# EAGLE design esp32-weatherstation-v1 (EAGLE 9.1.3)
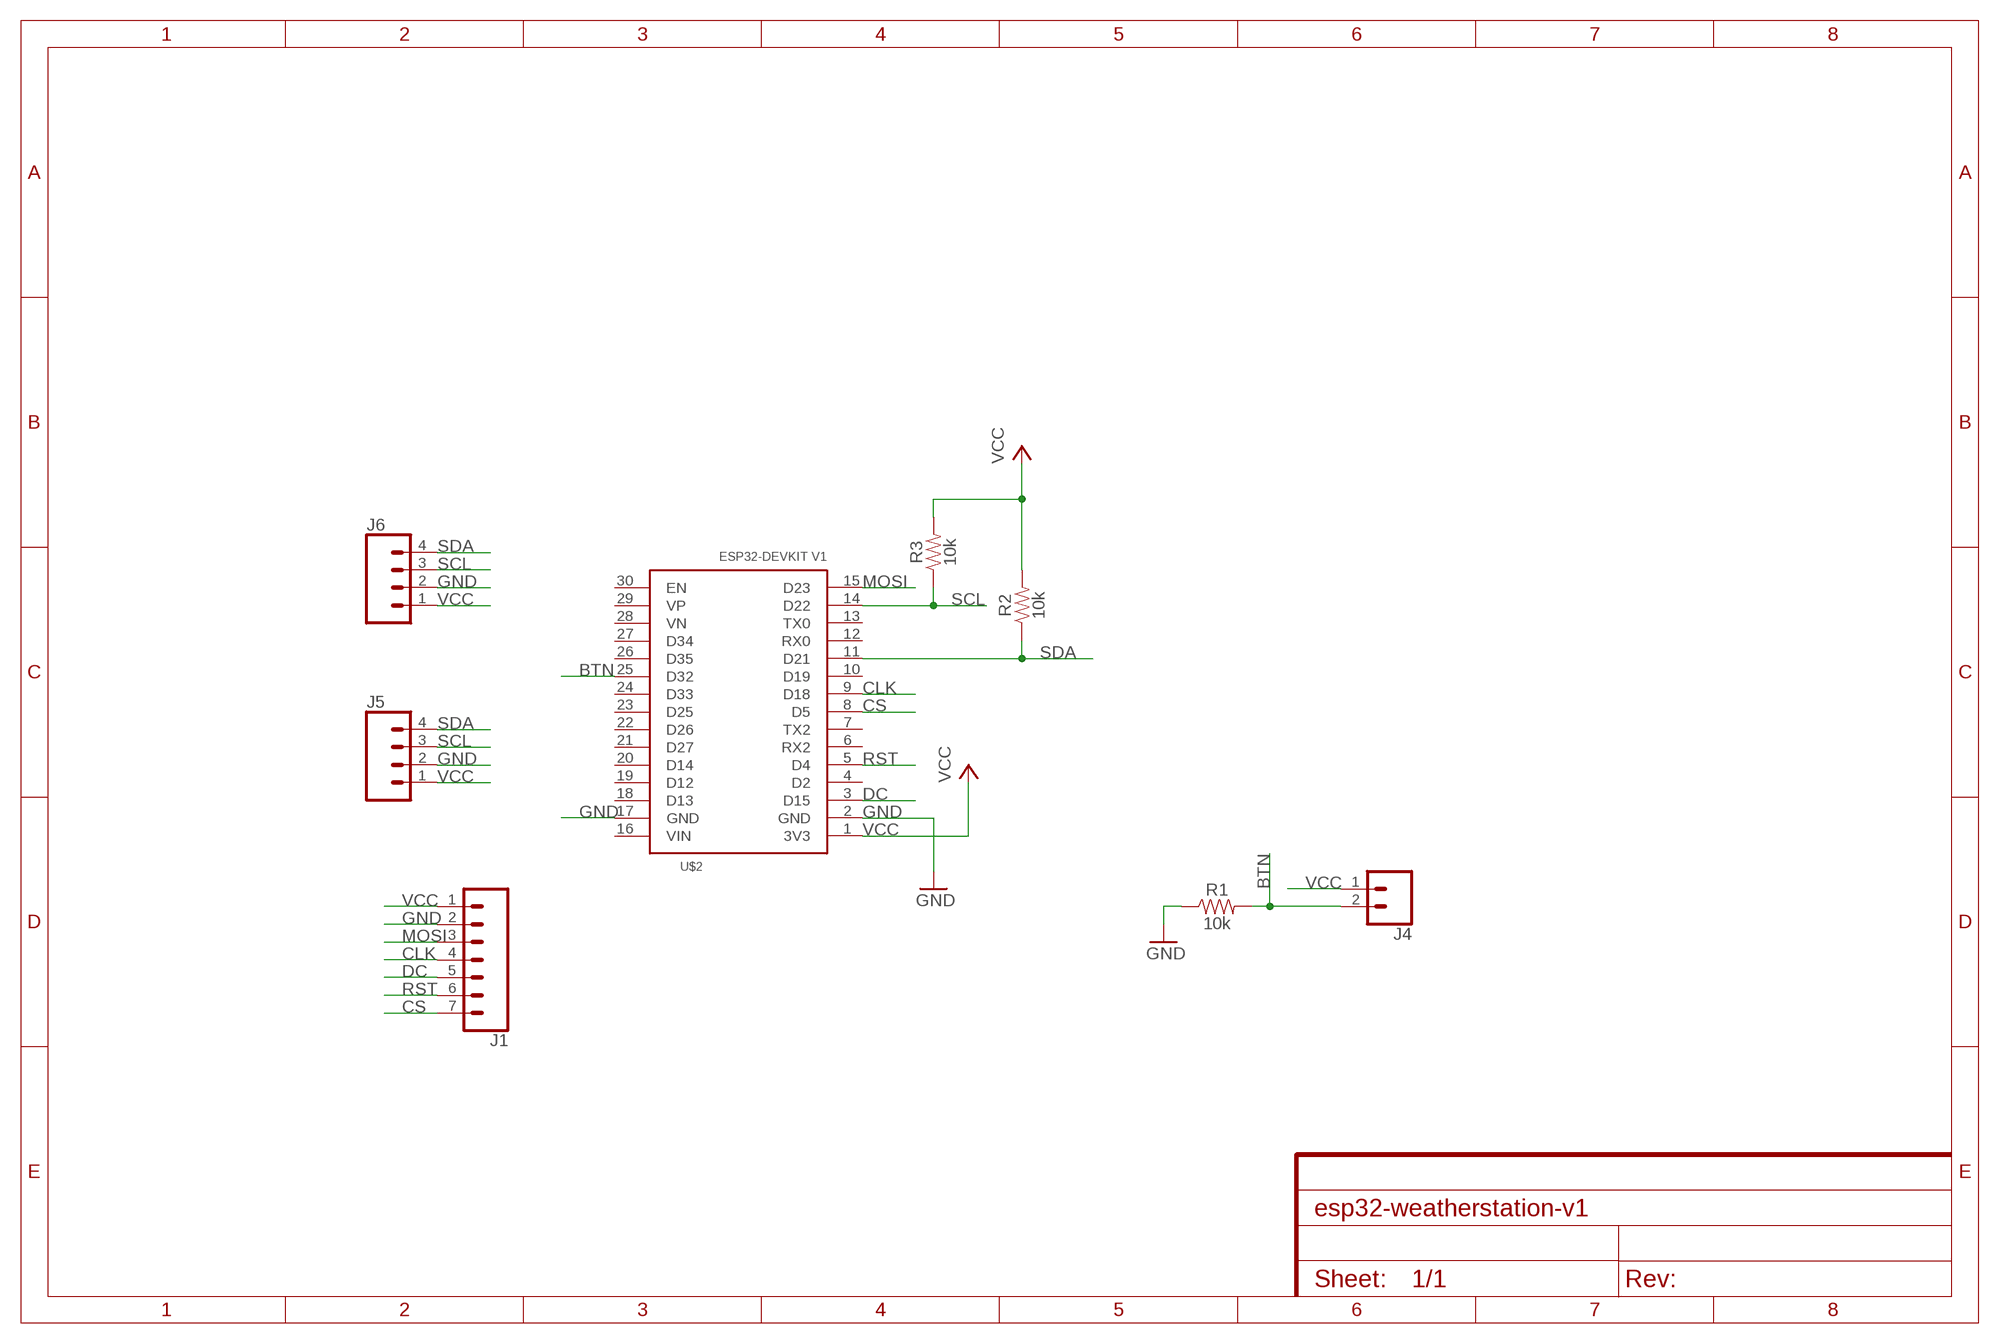
[diagram p0: schematic, sheet 1]

## Parts
J1  CONN_07  [1X07]
J4  CONN_02  [1X02]
J5  CONN_04POLAR  [MOLEX-1X4]
J6  CONN_04POLAR  [MOLEX-1X4]
R1  10k  10KOHM-HORIZ-1/4W-1%  [AXIAL-0.3]
R2  10k  10KOHM-HORIZ-1/4W-1%  [AXIAL-0.3]
R3  10k  10KOHM-HORIZ-1/4W-1%  [AXIAL-0.3]
U$2  DOIT-ESP32DEVKIT1  [ESP32-DEVKITV1]

## Nets
BTN: J4.2 R1.P$2 U$2.25(D32)
CLK: J1.4 U$2.9(D18)
CS: J1.7 U$2.8(D5)
DC: J1.5 U$2.3(D15)
GND: J1.2 J5.2 J6.2 R1.P$1 U$2.2(GND) U$2.17(GND)
MOSI: J1.3 U$2.15(D23)
RST: J1.6 U$2.5(D4)
SCL: J5.3 J6.3 R3.P$1 U$2.14(D22)
SDA: J5.4 J6.4 R2.P$1 U$2.11(D21)
VCC: J1.1 J4.1 J5.1 J6.1 R2.P$2 R3.P$2 U$2.1(3V3)
Unconnected: U$2.4(D2) U$2.6(RX2) U$2.7(TX2) U$2.10(D19) U$2.12(RX0) U$2.13(TX0) U$2.16(VIN) U$2.18(D13) U$2.19(D12) U$2.20(D14) U$2.21(D27) U$2.22(D26) U$2.23(D25) U$2.24(D33) U$2.26(D35) U$2.27(D34) U$2.28(VN) U$2.29(VP) U$2.30(EN)

## Library data of the parts
J1 = SparkFun-Connectors:CONN_07: Multi connection point. Often used as Generic Header-pin footprint for 0.1 inch spaced/style header connections On any of the 0.1 inch spaced packages, you can populate with these: Break Away Headers - Straight <https://www.sparkfun.com/products/116> (PRT-00116) Break Away Male Headers - Right Angle <https://www.sparkfun.com/products/553> (PRT-00553) Female Headers <https://www.sparkfun.com/products/115> (PRT-00115) Break Away Headers - Machine Pin <https://www.sparkfun.com/products/117> (PRT-00117) Break Away Female Headers - Swiss Machine Pin <https://www.sparkfun.com/products/743> (PRT-00743) For SCREWTERMINALS and SPRING TERMINALS visit here: Screw Terimnals on SparkFun.com <https://www.sparkfun.com/search/results?term=Screw+Terminals> (5mm/3.5mm/2.54mm spacing) This device is also useful as a general connection point to wire up your design to another part of your project. Our various solder wires solder well into these plated through hole pads. Hook-Up Wire - Assortment (Stranded, 22 AWG) <https://www.sparkfun.com/products/11375> (PRT-11375) Hook-Up Wire - Assortment (Solid Core, 22 AWG) <https://www.sparkfun.com/products/11367> (PRT-11367) View the entire wire category on our website here <https://www.sparkfun.com/categories/141> Special notes: Molex polarized connector foot print use with SKU : PRT-08231 with associated crimp pins and housings. 1MM SMD Version SKU: PRT-10208 NOTES ON THE VARIANTS LOCK and LOCK_LONGPADS... This footprint was designed to help hold the alignment of a through-hole component (i.e. 6-pin header) while soldering it into place. You may notice that each hole has been shifted either up or down by 0.005 of an inch from it's more standard position (which is a perfectly straight line). This slight alteration caused the pins (the squares in the middle) to touch the edges of the holes. Because they are alternating, it causes a "brace" to hold the component in place. 0.005 has proven to be the perfect amount of "off-center" position when using our standard breakaway headers. Although looks a little odd when you look at the bare footprint, once you have a header in there, the alteration is very hard to notice. Also,if you push a header all the way into place, it is covered up entirely on the bottom side.
J4 = SparkFun-Connectors:CONN_02: Multi connection point. Often used as Generic Header-pin footprint for 0.1 inch spaced/style header connections On any of the 0.1 inch spaced packages, you can populate with these: Break Away Headers - Straight <https://www.sparkfun.com/products/116> (PRT-00116) Break Away Male Headers - Right Angle <https://www.sparkfun.com/products/553> (PRT-00553) Female Headers <https://www.sparkfun.com/products/115> (PRT-00115) Break Away Headers - Machine Pin <https://www.sparkfun.com/products/117> (PRT-00117) Break Away Female Headers - Swiss Machine Pin <https://www.sparkfun.com/products/743> (PRT-00743) For SCREWTERMINALS and SPRING TERMINALS visit here: Screw Terimnals on SparkFun.com <https://www.sparkfun.com/search/results?term=Screw+Terminals> (5mm/3.5mm/2.54mm spacing) This device is also useful as a general connection point to wire up your design to another part of your project. Our various solder wires solder well into these plated through hole pads. Hook-Up Wire - Assortment (Stranded, 22 AWG) <https://www.sparkfun.com/products/11375> (PRT-11375) Hook-Up Wire - Assortment (Solid Core, 22 AWG) <https://www.sparkfun.com/products/11367> (PRT-11367) View the entire wire category on our website here <https://www.sparkfun.com/categories/141> Special notes: Molex polarized connector foot print use with: PRT-08233 with associated crimp pins and housings. 2.54_SCREWTERM for use with PRT-10571. 3.5mm Screw Terminal footprints for PRT-08084 5mm Screw Terminal footprints for use with PRT-08432
J5 J6 = SparkFun-Connectors:CONN_04: Multi connection point. Often used as Generic Header-pin footprint for 0.1 inch spaced/style header connections On any of the 0.1 inch spaced packages, you can populate with these: Break Away Headers - Straight <https://www.sparkfun.com/products/116> (PRT-00116) Break Away Male Headers - Right Angle <https://www.sparkfun.com/products/553> (PRT-00553) Female Headers <https://www.sparkfun.com/products/115> (PRT-00115) Break Away Headers - Machine Pin <https://www.sparkfun.com/products/117> (PRT-00117) Break Away Female Headers - Swiss Machine Pin <https://www.sparkfun.com/products/743> (PRT-00743) For SCREWTERMINALS and SPRING TERMINALS visit here: Screw Terimnals on SparkFun.com <https://www.sparkfun.com/search/results?term=Screw+Terminals> (5mm/3.5mm/2.54mm spacing) This device is also useful as a general connection point to wire up your design to another part of your project. Our various solder wires solder well into these plated through hole pads. Hook-Up Wire - Assortment (Stranded, 22 AWG) <https://www.sparkfun.com/products/11375> (PRT-11375) Hook-Up Wire - Assortment (Solid Core, 22 AWG) <https://www.sparkfun.com/products/11367> (PRT-11367) View the entire wire category on our website here <https://www.sparkfun.com/categories/141> Special notes: Molex polarized connector foot print use with SKU : PRT-08231 with associated crimp pins and housings. 1MM SMD Version SKU: PRT-10208; PROD_ID: CONN-08186; SF_ID: PRT-08231
R1-R3 = SparkFun-Resistors:10KOHM: 10kΩ resistor A resistor is a passive two-terminal electrical component that implements electrical resistance as a circuit element. Resistors act to reduce current flow, and, at the same time, act to lower voltage levels within circuits. - Wikipedia; PROD_ID: RES-12183
U$2 = ESP32-DEVKIT1:DOIT-ESP32DEVKIT1

## Board
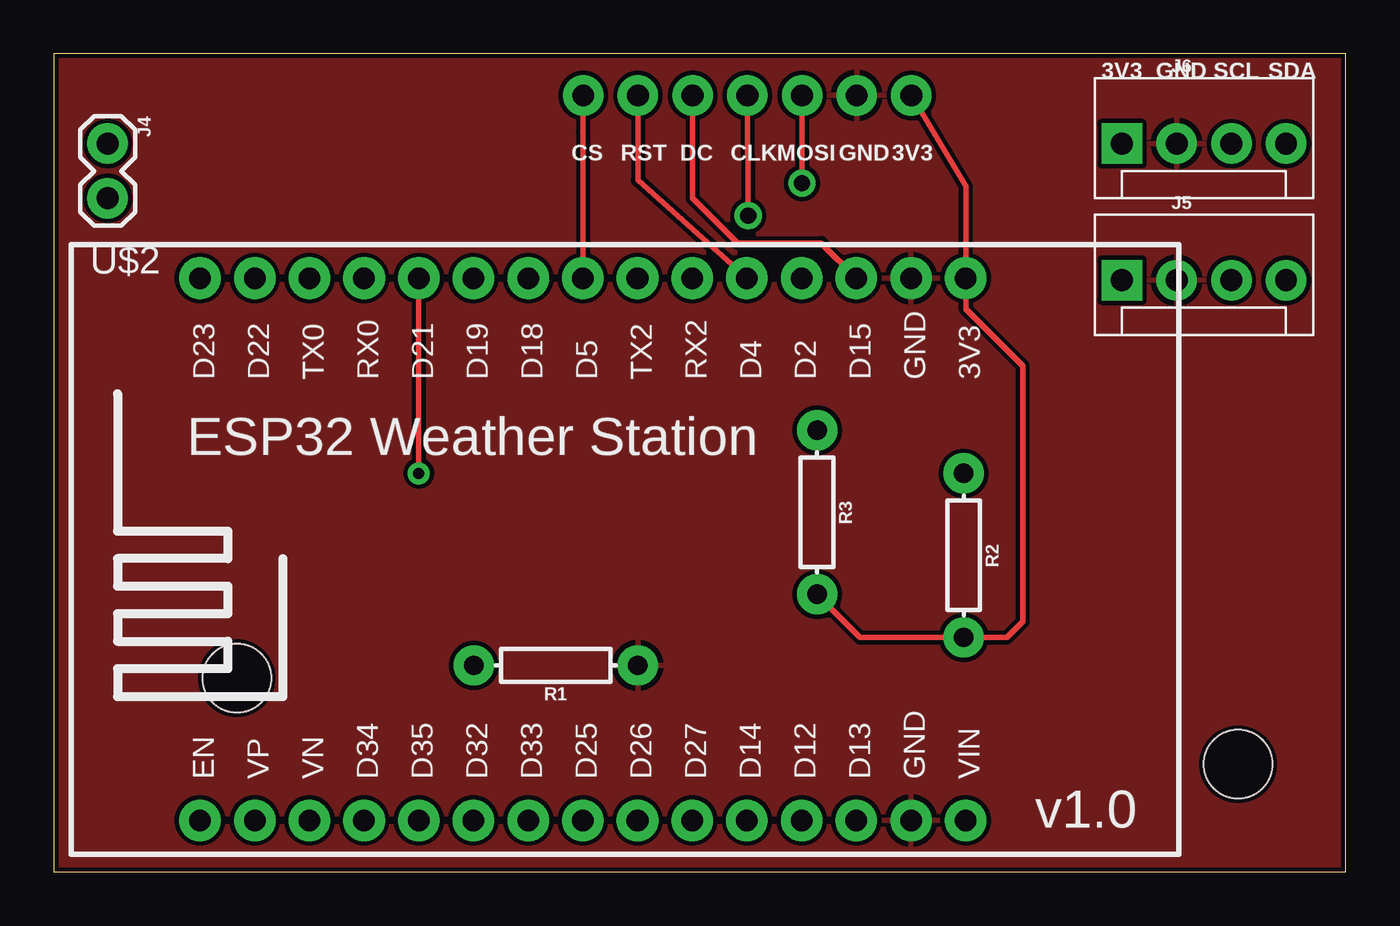
[diagram p1: board, top side]
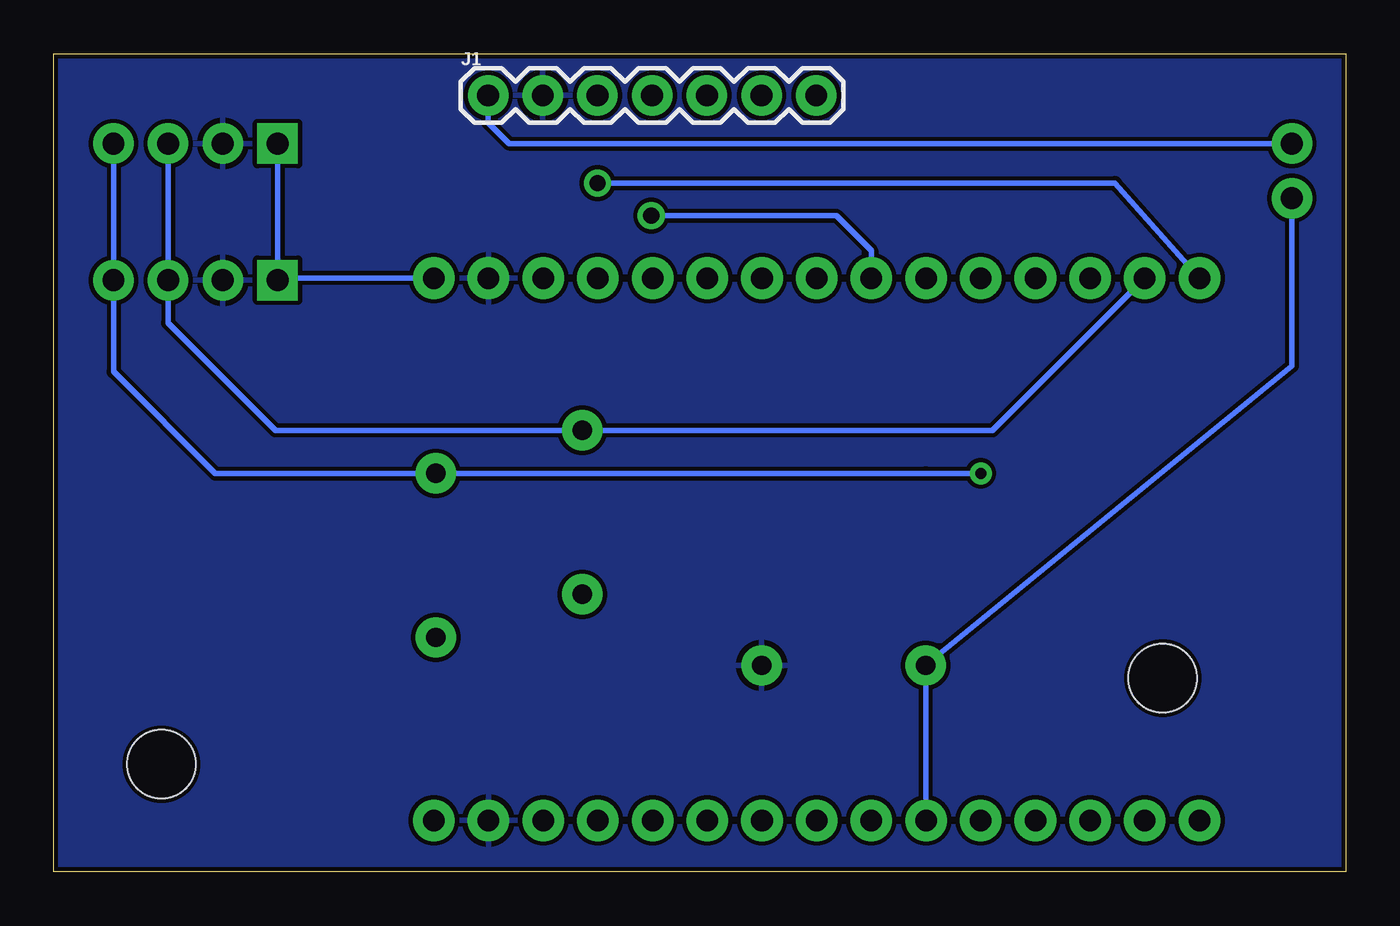
[diagram p2: board, bottom side, seen from below]

Size 60 x 38 mm. Coordinates in mm from the lower left corner, seen from the top.
Outline: 0,0 60,0 60,38 0,38 0,0
Copper layers (1*16): Top 0.035mm / dielectric 1.5mm / Bottom 0.035mm
Design rules "SparkFun": minimum track width 8mil, minimum drill 20mil, track to track 8mil, track to pad 8mil, pad to pad 8mil, via to via 8mil, smd to smd 8mil, copper to edge 8mil, drill to drill 8mil, minimum pad ring 12mil, minimum via ring 10mil, stop-mask expansion 4mil, vias tented up to drill 20mil, thermal gap 10mil
Holes 3.17 mm at 55,5 8.5,9

### Footprints (pad centres in the part's own frame; a part is rotated, then mirrored left to right if it is on the bottom)
1X07 = drill 1.016 pad 1.88: 1 0,0; 2 2.54,0; 3 5.08,0; 4 7.62,0; 5 10.16,0; 6 12.7,0; 7 15.24,0
1X02 = drill 1.016 pad 1.88: 1 0,0; 2 2.54,0
MOLEX-1X4 = drill 1.016 pad 1.88 square: 1 0,0 | drill 1.016 pad 1.88: 2 2.54,0; 3 5.08,0; 4 7.62,0
AXIAL-0.3 = drill 0.9 pad 1.88: P$1 -3.81,0; P$2 3.81,0
ESP32-DEVKITV1 = drill 1 pad 1.93: 1 41.54,26.77; 2 39,26.77; 3 36.46,26.77; 4 33.92,26.77; 5 31.38,26.77; 6 28.84,26.77; 7 26.3,26.77; 8 23.76,26.77; 9 21.22,26.77; 10 18.68,26.77; 11 16.14,26.77; 12 13.6,26.77; 13 11.06,26.77; 14 8.52,26.77; 15 5.98,26.77; 16 41.54,1.58; 17 39,1.58; 18 36.46,1.58; 19 33.92,1.58; 20 31.38,1.58; 21 28.84,1.58; 22 26.3,1.58; 23 23.76,1.58; 24 21.22,1.58; 25 18.68,1.58; 26 16.14,1.58; 27 13.6,1.58; 28 11.06,1.58; 29 8.52,1.58; 30 5.98,1.58

### Placement (x,y rotation side)
J1  39.83,36.07 0 bottom
J4  2.5,33.83 270 top
J5  49.61,27.48 0 top
J6  49.61,33.83 0 top
R1  23.32,9.59 180 top
R2  42.26,14.7 270 top
R3  35.45,16.7 270 top
U$2  0.81,0.81 0 top

### Tracks (layer width: path | path; a pad name or v marks a point on that pad's centre or on a via)
BTN
  Bottom 0.254: J4.2 2.5,23.5 R1.P$2 19.49,9.57 U$2.25
CLK  (via drill 0.75)
  Top 0.254: J1.4 v32.25,30.48
  Bottom 0.254: v32.25,30.48 23.66,30.48 22.03,28.85 U$2.9
CS
  Top 0.254: J1.7 24.57,34.35 U$2.8
DC
  Top 0.254: J1.5 29.67,31.29 31.75,29.21 35.64,29.21 U$2.3
GND
  pour Bottom (isolate 0.012): 0,38.1 59.69,38.1 59.69,0 0,0
  pour Top (isolate 0.012): 0,38.1 59.69,38.1 59.69,0 0,0
MOSI  (via drill 0.75)
  Top 0.254: J1.3 v34.75,32
  Bottom 0.254: v34.75,32 10.71,32 U$2.15
RST
  Top 0.254: J1.6 27.13,32.14 U$2.5
SCL
  Bottom 0.254: J6.3 54.69,27.5 | 54.69,27.5 J5.3 | 54.69,27.5 54.69,25.5 49.7,20.51 R3.P$1 16.4,20.51 U$2.14
SDA  (via drill 0.51)
  Top 0.254: U$2.11 v16.95,18.51
  Bottom 0.254: J6.4 J5.4 57.23,23.23 52.5,18.5 R2.P$1 19.51,18.51 19.5,18.51 v16.95,18.51
VCC
  Top 0.254: J1.1 42.35,31.85 U$2.1 42.35,26.15 45,23.5 45,11.63 44.26,10.89 R2.P$2 37.45,10.89 R3.P$2
  Bottom 0.254: J6.1 49.61,28 J5.1 49.51,27.58 U$2.1 | J4.1 38.86,33.83 39.83,34.8 J1.1

### Text on the board
tPlace: 3V3 | GND | SCL | SDA | CS | RST | DC | CLK | MOSI | GND | 3V3 | ESP32 Weather Station | v1.0